# EAGLE design tiva_motor (EAGLE 7.5.0)
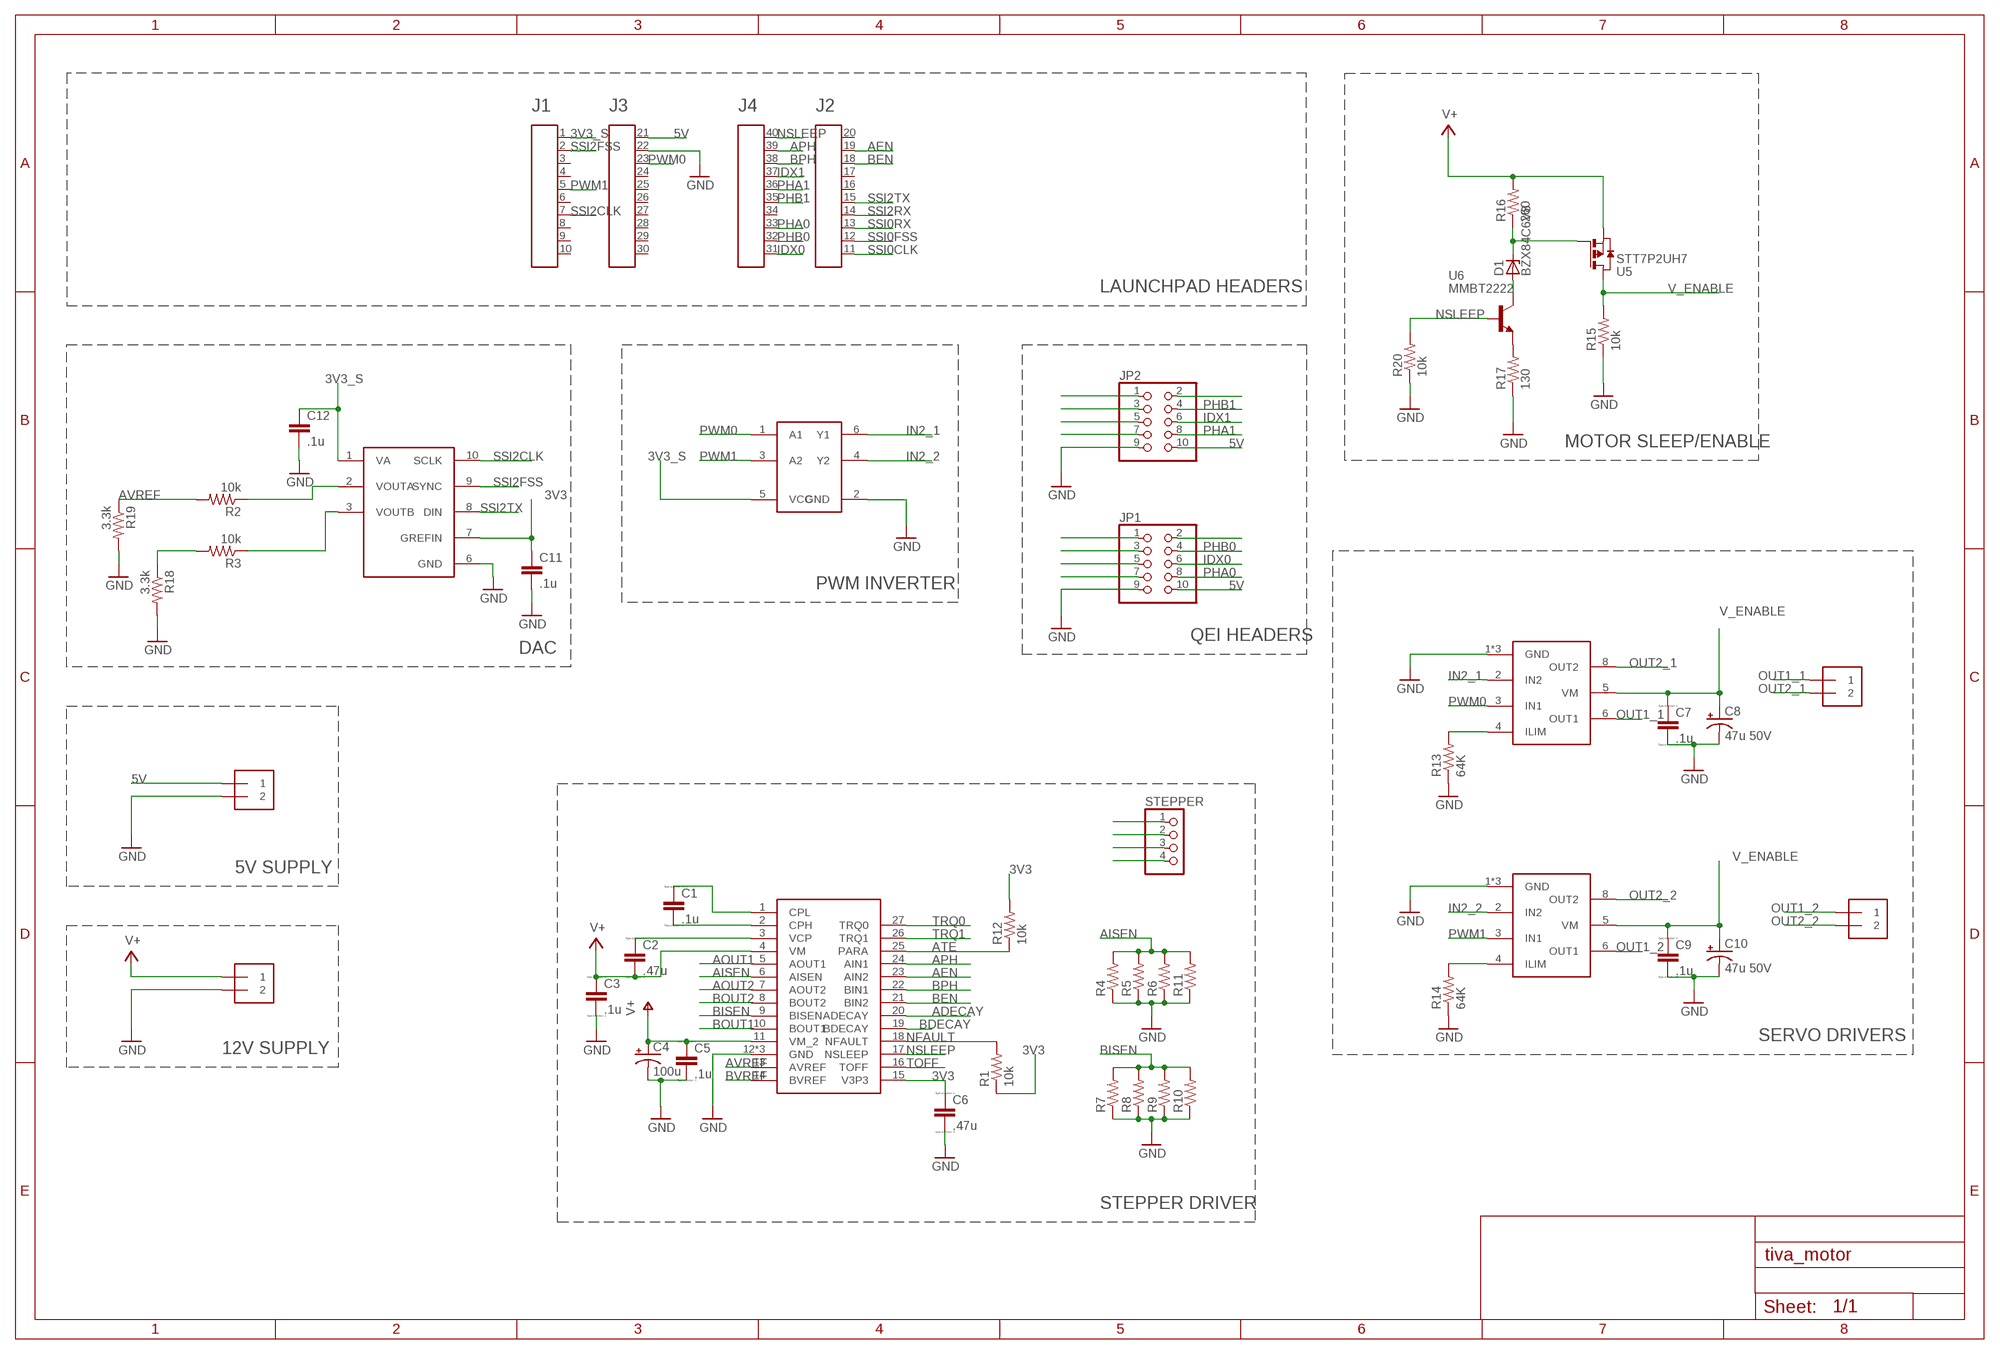
[diagram p0: schematic, sheet 1]

## Parts
5V  1X2-3.5MM  [1X2-3.5MM]
12V  1X2-3.5MM  [1X2-3.5MM]
A1  HEADER4X10-BOOSTERPACK  [4X10-BOOSTERPACK]
C1  .1u  CC0603  [C0603]
C2  .47u  CC0603  [C0603]
C3  .1u  CC0603  [C0603]
C4  100u  CPOL-US153CLV-0605  [153CLV-0605]
C5  .1u  CC0603  [C0603]
C6  .47u  CC0603  [C0603]
C7  .1u  CC0603  [C0603]
C8  47u 50V  CPOL-US153CLV-0605  [153CLV-0605]
C9  .1u  CC0603  [C0603]
C10  47u 50V  CPOL-US153CLV-0605  [153CLV-0605]
C11  .1u  C-EUC0402  [C0402]
C12  .1u  C-EUC0402  [C0402]
D1  BZX84C6V8  [SOT-23]
JP1  PINHD-2X5  [2X05]
JP2  PINHD-2X5  [2X05]
M1  1X2-3.5MM  [1X2-3.5MM]
M2  1X2-3.5MM  [1X2-3.5MM]
R1  10k  R-US_R0402  [R0402]
R2  10k  R-US_R0603  [R0603]
R3  10k  R-US_R0603  [R0603]
R4  R-US_R0603  [R0603]
R5  R-US_R0603  [R0603]
R6  R-US_R0603  [R0603]
R7  R-US_R0603  [R0603]
R8  R-US_R0603  [R0603]
R9  R-US_R0603  [R0603]
R10  R-US_R0603  [R0603]
R11  R-US_R0603  [R0603]
R12  10k  R-US_R0402  [R0402]
R13  64K  R-US_R0603  [R0603]
R14  64K  R-US_R0603  [R0603]
R15  10k  R-US_R0402  [R0402]
R16  260  R-US_R0805  [R0805]
R17  130  R-US_R1206  [R1206]
R18  3.3k  R-US_R0603  [R0603]
R19  3.3k  R-US_R0603  [R0603]
R20  10k  R-US_R0402  [R0402]
STEPPER  PINHD-1X4  [1X04]
U1  DRV8881  [TSSOP28]
U2  DRV8871  [SOIC127P600X170-9N]
U4  DRV8871  [SOIC127P600X170-9N]
U5  STT7P2UH7  [SOT23-6]
U6  MMBT2222  [SOT-23]
U8  DAC082S085  [SOP50P490X110-10N]
U9  NC7WZ14  [SC70-6]

## Nets
3V3: C6.1 C11.1 R1.1 R12.2 U1.15(V3P3) U8.7(GREFIN)
3V3_S: A1.1 C12.1 U8.1(VA) U9.5(VCC)
5V: 5V.1 A1.21 JP1.10 JP2.10
ADECAY: U1.20(ADECAY)
AEN: A1.19 U1.23(AIN2)
AISEN: R4.2 R5.2 R6.2 R11.2 U1.6(AISEN)
AOUT1: STEPPER.1 U1.5(AOUT1)
AOUT2: STEPPER.2 U1.7(AOUT2)
APH: A1.39 U1.24(AIN1)
ATE: R12.1 U1.25(PARA)
AVREF: R2.2 R19.1 U1.13(AVREF)
BDECAY: U1.19(BDECAY)
BEN: A1.18 U1.21(BIN2)
BISEN: R7.2 R8.2 R9.2 R10.2 U1.9(BISEN)
BOUT1: STEPPER.3 U1.10(BOUT1)
BOUT2: STEPPER.4 U1.8(BOUT2)
BPH: A1.38 U1.22(BIN1)
BVREF: R3.2 R18.1 U1.14(BVREF)
GND: 5V.2 12V.2 A1.22 C3.2 C4.- C5.2 C6.2 C7.2 C8.- C9.2 C10.- C11.2 C12.2 JP1.9 JP2.9 R4.1 R5.1 R6.1 R7.1 R8.1 R9.1 R10.1 R11.1 R13.1 R14.1 R15.1 R17.1 R18.2 R19.2 R20.1 U1.12(GND) U1.28(GND) U1.P$1(GND) U2.1(GND) U2.7(GND) U2.9(GND) U4.1(GND) U4.7(GND) U4.9(GND) U8.6(GND) U9.2(GND)
IDX0: A1.31 JP1.6
IDX1: A1.37 JP2.6
ILIM: R13.2 U2.4(ILIM)
ILIM1: R14.2 U4.4(ILIM)
IN2_1: U2.2(IN2) U9.6(Y1)
IN2_2: U4.2(IN2) U9.4(Y2)
N$1: C1.2 U1.2(CPH)
N$2: C1.1 U1.1(CPL)
N$3: C2.1 U1.3(VCP)
N$4: R17.2 U6.2(E)
N$5: D1.3(C) R16.1 U5.3(G)
N$6: R2.1 U8.2(VOUTA)
N$7: R3.1 U8.3(VOUTB)
N$8: D1.1(A) U6.3(C)
N$9: JP1.1
N$10: JP1.3
N$11: JP1.5
N$12: JP1.7
N$13: JP2.1
N$15: JP2.3
N$16: JP2.5
N$17: JP2.7
N$18: JP2.2
NC: JP1.2
NFAULT: R1.2 U1.18(NFAULT)
NSLEEP: A1.40 R20.2 U1.17(NSLEEP) U6.1(B)
OUT1_1: M1.1 U2.6(OUT1)
OUT1_2: M2.1 U4.6(OUT1)
OUT2_1: M1.2 U2.8(OUT2)
OUT2_2: M2.2 U4.8(OUT2)
PHA0: A1.33 JP1.8
PHA1: A1.36 JP2.8
PHB0: A1.32 JP1.4
PHB1: A1.35 JP2.4
PWM0: A1.23 U2.3(IN1) U9.1(A1)
PWM1: A1.5 U4.3(IN1) U9.3(A2)
SSI0CLK: A1.11
SSI0FSS: A1.12
SSI0RX: A1.13
SSI2CLK: A1.7 U8.10(SCLK)
SSI2FSS: A1.2 U8.9(SYNC)
SSI2RX: A1.14
SSI2TX: A1.15 U8.8(DIN)
TOFF: U1.16(TOFF)
TRQ0: U1.27(TRQ0)
TRQ1: U1.26(TRQ1)
V+: 12V.1 C2.2 C3.1 C4.+ C5.1 R16.2 U1.4(VM) U1.11(VM_2) U5.4(S)
V_ENABLE: C7.1 C8.+ C9.1 C10.+ R15.2 U2.5(VM) U4.5(VM) U5.1(D) U5.2(D) U5.5(D) U5.6(D)
Unconnected: A1.3 A1.4 A1.6 A1.8 A1.9 A1.10 A1.16 A1.17 A1.20 A1.24 A1.25 A1.26 A1.27 A1.28 A1.29 A1.30 A1.34

## Notes on the sheet
- LAUNCHPAD HEADERS
- MOTOR SLEEP/ENABLE
- PWM INVERTER
- QEI HEADERS
- DAC
- 5V SUPPLY
- SERVO DRIVERS
- 12V SUPPLY
- STEPPER DRIVER

## Library data of the parts
5V 12V M1 M2 = adafruit:1X2: 3.5mm Terminal block http://www.ladyada.net/library/pcb/eaglelibrary.html
A1 = Public_BP_Library:HEADER4X10-BOOSTERPACK
C1-C3 C5-C7 C9 = eagle-ltspice:C: CAPACITOR, European symbol; SPICEMODEL: NONE; SPICEPREFIX: C
C4 C8 C10 = adafruit:CPOL-US: POLARIZED CAPACITOR, American symbol
C11 C12 = rcl:C-EU: CAPACITOR, European symbol
D1 = deanParts:BZX84C6V8: 6.8V zener
JP1 JP2 = pinhead:PINHD-2X5: PIN HEADER
R1-R20 = adafruit:R-US_: RESISTOR, American symbol
STEPPER = pinhead:PINHD-1X4: PIN HEADER
U1 = deanParts:DRV8881: DRV8881 Motor driver
U2 U4 = deanParts:DRV8871: DRV8871 PWM motor controller
U5 = deanParts:STT7P2UH7: P channel enhancement mosfet STT7P2UH7
U6 = deanParts:MMBT2222
U8 = deanParts:DAC082S085: 8-Bit Micro Power DUAL Digital-to-Analog Converter with Rail-to-Rail Output
U9 = deanParts:NC7WZ14: UHS dual inverter with schmitt trigger inputs

## Board
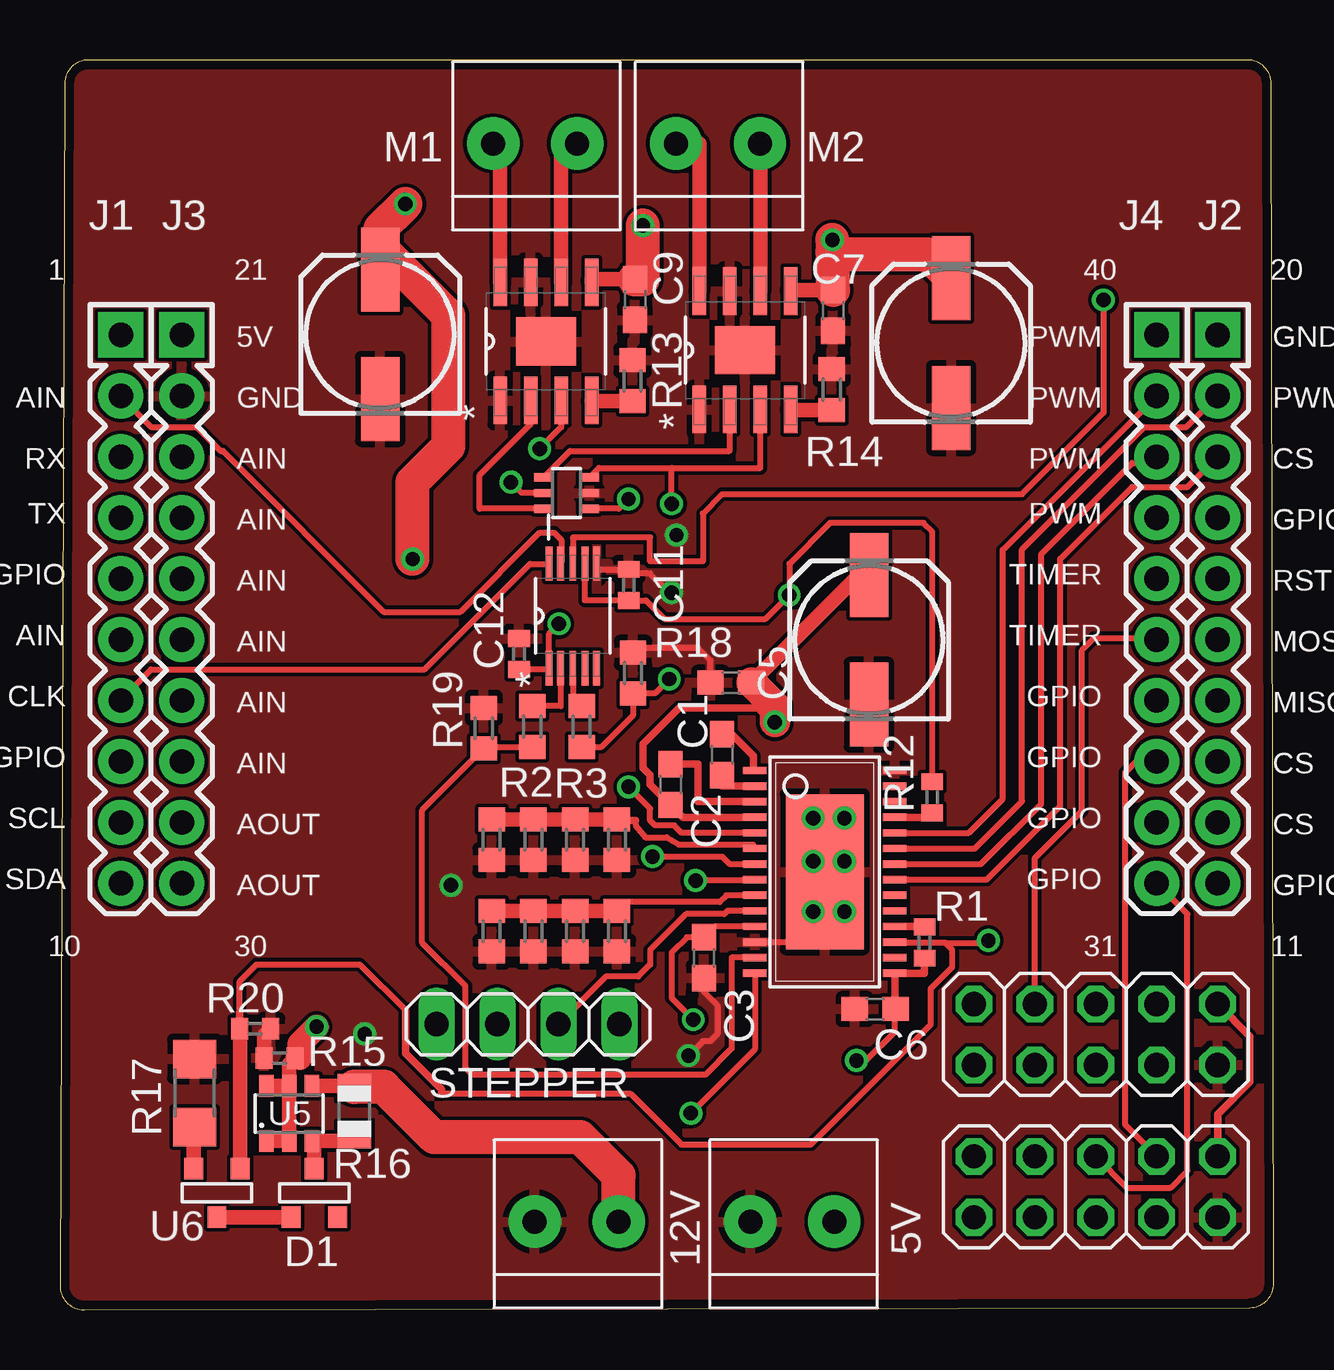
[diagram p1: board, top side]
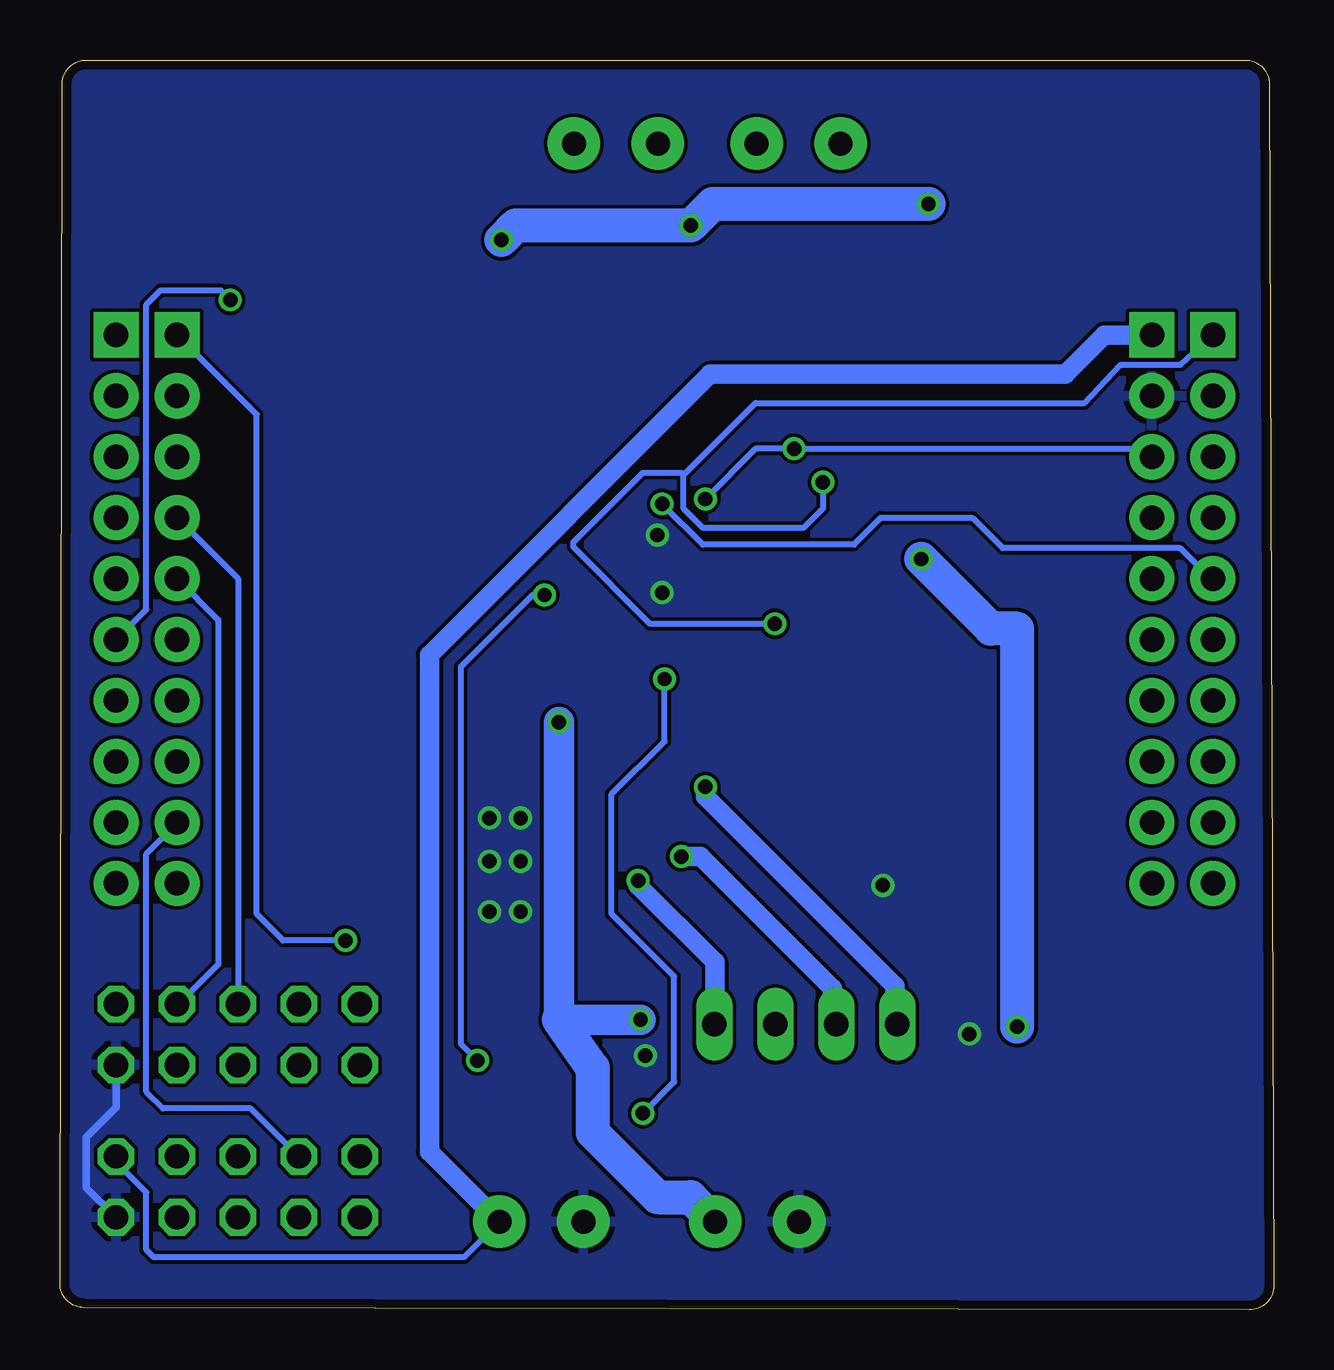
[diagram p2: board, bottom side, seen from below]

Size 50.59 x 52.1 mm. Coordinates in mm from the lower left corner, seen from the top.
Outline: 0.19,51.1 0,1 arc90 1,0 49.6,0.1 arc90 50.59,1.1 50.5,51.1 arc90 49.5,52.1 1.19,52.1 arc90 0.19,51.1
Copper layers (1*16): Top 0.0356mm / dielectric 1.5011mm / Bottom 0.0356mm
Design rules "oshpark-2layer *": minimum track width 6mil, minimum drill 13mil, track to track 6mil, track to pad 6mil, pad to pad 6mil, via to via 6mil, smd to smd 6mil, copper to edge 15mil, drill to drill 6mil, minimum pad ring 7mil, minimum via ring 7mil, stop-mask expansion 0mil, vias tented up to drill 0mil, thermal gap 10mil

### Footprints (pad centres in the part's own frame; a part is rotated, then mirrored left to right if it is on the bottom)
1X2-3.5MM = drill 1 pad 2.184: 1 1.8,0; 2 -1.7,0
4X10-BOOSTERPACK = drill 1.016 pad 1.88 square: 1 0,10.16; 20 45.72,10.16; 21 2.54,10.16; 40 43.18,10.16 | drill 1.016 pad 1.88: 2 0,7.62; 3 0,5.08; 4 0,2.54; 5 0,0; 6 0,-2.54; 7 0,-5.08; 8 0,-7.62; 9 0,-10.16; 10 0,-12.7; 11 45.72,-12.7; 12 45.72,-10.16; 13 45.72,-7.62; 14 45.72,-5.08; 15 45.72,-2.54; 16 45.72,0; 17 45.72,2.54; 18 45.72,5.08; 19 45.72,7.62; 22 2.54,7.62; 23 2.54,5.08; 24 2.54,2.54; 25 2.54,0; 26 2.54,-2.54; 27 2.54,-5.08; 28 2.54,-7.62; 29 2.54,-10.16; 30 2.54,-12.7; 31 43.18,-12.7; 32 43.18,-10.16; 33 43.18,-7.62; 34 43.18,-5.08; 35 43.18,-2.54; 36 43.18,0; 37 43.18,2.54; 38 43.18,5.08; 39 43.18,7.62
C0603 = smd 1.1 x 1: 1 -0.85,0; 2 0.85,0
153CLV-0605 = smd 3.5 x 1.6: + 2.7,0; - -2.7,0
C0402 = smd 0.7 x 0.9: 1 -0.65,0; 2 0.65,0
SOT-23 = smd 0.787 x 0.889: 1 0.991,1.016; 2 -0.94,1.016; 3 0.025,-1.016
2X05 = drill 1.016 octagon: 1 -5.08,-1.27; 2 -5.08,1.27; 3 -2.54,-1.27; 4 -2.54,1.27; 5 0,-1.27; 6 0,1.27; 7 2.54,-1.27; 8 2.54,1.27; 9 5.08,-1.27; 10 5.08,1.27
R0402 = smd 0.7 x 0.9: 1 -0.65,0; 2 0.65,0
R0603 = smd 1 x 1.1: 1 -0.85,0; 2 0.85,0
R0805 = smd 1.1 x 1.4: 1 -1,0; 2 1,0
R1206 = smd 1.6 x 1.803: 1 -1.422,0; 2 1.422,0
1X04 = drill 1.016 long: 1 -3.81,0; 2 -1.27,0; 3 1.27,0; 4 3.81,0
TSSOP28 = smd 0.305 x 0.991: 1 -4.225,-2.918; 2 -3.575,-2.918; 3 -2.925,-2.918; 4 -2.275,-2.918; 5 -1.625,-2.918; 6 -0.975,-2.918; 7 -0.325,-2.918; 8 0.325,-2.918; 9 0.975,-2.918; 10 1.625,-2.918; 11 2.275,-2.918; 12 2.925,-2.918; 13 3.575,-2.918; 14 4.225,-2.918; 15 4.225,2.918; 16 3.575,2.918; 17 2.925,2.918; 18 2.275,2.918; 19 1.625,2.918; 20 0.975,2.918; 21 0.325,2.918; 22 -0.325,2.918; 23 -0.975,2.918; 24 -1.625,2.918; 25 -2.275,2.918; 26 -2.925,2.918; 27 -3.575,2.918; 28 -4.225,2.918 | smd 6.452 x 3.251: P$1 0,0
SOIC127P600X170-9N = smd 1.981 x 0.559: 1 -2.464,1.905; 2 -2.464,0.635; 3 -2.464,-0.635; 4 -2.464,-1.905; 5 2.464,-1.905; 6 2.464,-0.635; 7 2.464,0.635; 8 2.464,1.905 | smd 2.007 x 2.489: 9 0,0
SOT23-6 = smd 0.6 x 0.9: 1 -0.95,-1.15; 2 0,-1.15; 3 0.95,-1.15; 4 0.95,1.15; 5 0,1.15; 6 -0.95,1.15
SOP50P490X110-10N = smd 1.422 x 0.279: 1 -2.184,0.991; 2 -2.184,0.508; 3 -2.184,0; 4 -2.184,-0.508; 5 -2.184,-0.991; 6 2.184,-0.991; 7 2.184,-0.508; 8 2.184,0; 9 2.184,0.508; 10 2.184,0.991
SC70-6 = smd 0.35 x 0.8: 1 -0.65,-0.95; 2 0,-0.95; 3 0.65,-0.95; 4 0.65,0.95; 5 0,0.95; 6 -0.65,0.95

### Placement (x,y rotation side)
5V  30.48,3.68 0 top
12V  21.49,3.68 0 top
A1  2.54,30.48 0 top
C1  27.6,23.14 270 top
C2  25.46,21.9 270 top
C3  26.84,14.68 270 top
C4  33.73,27.93 90 top
C5  27.97,26.15 180 top
C6  33.98,12.54 180 top
C7  32.23,41.66 270 top
C8  37.15,40.3 90 top
C9  23.97,42.11 270 top
C10  13.35,40.67 90 top
C11  23.71,30.22 90 top
C12  19.14,27.34 90 top
D1  10.63,4.88 180 top
JP1  43.18,5.13 0 top
JP2  43.18,11.48 0 top
M1  19.76,48.62 0 top
M2  27.38,48.62 0 top
R1  36.04,15.31 90 top
R2  19.69,24.32 270 top
R3  21.75,24.32 270 top
R4  23.22,19.6 90 top
R5  21.48,19.6 90 top
R6  19.74,19.6 90 top
R7  23.22,15.79 90 top
R8  21.48,15.79 90 top
R9  19.74,15.79 90 top
R10  18,15.79 90 top
R11  18,19.6 90 top
R12  36.36,21.37 90 top
R13  23.87,38.73 270 top
R14  32.17,38.36 270 top
R15  9.16,10.5 0 top
R16  12.27,8.29 90 top
R17  5.62,9.04 270 top
R18  23.89,26.55 90 top
R19  17.67,24.25 90 top
R20  8.14,11.72 180 top
STEPPER  19.51,11.91 0 top
U1  31.88,18.26 270 top
U2  20.26,40.37 90 top
U4  28.56,40 90 top
U5  9.56,8.19 0 top
U6  6.52,4.88 0 top
U8  21.38,28.93 90 top
U9  21.12,34.05 90 top

### Tracks (layer width: path | path; a pad name or v marks a point on that pad's centre or on a via)
3V3  (via drill 0.6)
  Top 0.254: U8.7 21.88,29.57 C11.1 24.43,29.57 25.2,28.8 29.4,28.8 v30.4,29.8 30.4,31.1 32.1,32.8 36,32.8 36.36,32.44 R12.2 | v33.2,10.4 33.6,10.4 34.8,11.6 34.8,12.51 C6.1
  Top 0.305: C6.1 34.79,12.57 U1.15 36.04,14.03 R1.1
  Bottom 0.254: v30.4,29.8 30.9,29.8 33.9,26.8 33.9,11.1 v33.2,10.4
3V3_S  (via drill 0.6)
  Top 0.254: C12.1 20.39,26.69 U8.1 20.39,28.19 v20.8,28.6 | U9.5 19.25,34.05 v18.8,34.5
  Bottom 0.254: v18.8,34.5 18.8,33.4 19.6,32.6 23.8,32.6 24.6,33.4 24.6,34.8 | 24.6,34.8 21.6,37.8 7.9,37.8 6.4,39.4 3.88,39.4 A1.1 | v20.8,28.6 26,28.6 29.2,31.8 29.2,32 26.3,34.9 24.7,34.9 24.6,34.8
5V
  Top 0.305: JP1.10 48.26,8.16 49.6,9.5 49.6,11.41 JP2.10
  Bottom 0.254: 5V.1 33.76,2.2 46.7,2.2 47,2.5 47,4.9 48.26,6.16 JP1.10
  Bottom 0.813: A1.21 7.06,40.64 8.7,39 23.5,39 35.2,27.3 35.2,6.6 5V.1
AEN
  Top 0.254: U1.23 38.13,19.23 40.1,21.2 40.1,31.7 45.2,36.8 46.96,36.8 A1.19
AISEN
  Top 0.254: 24,20.4 24,20.2 24.4,19.7 25.3,19.7 25.8,19.4 28.89,19.4 U1.6
  Top 0.305: 24,20.4 23.27,20.4 R4.2
  Top 0.61: R4.2 R5.2 R6.2 R11.2
AOUT1  (via drill 0.6)
  Top 0.254: U1.5 25.91,19.88 25.6,20.2 24.8,20.2 24.6,20.4 24.6,20.9 v23.7,21.8
  Bottom 0.813: v23.7,21.8 23.7,21.4 15.8,13.5 15.8,12.01 STEPPER.1
AOUT2  (via drill 0.6)
  Top 0.254: v24.7,18.9 27.6,18.9 27.9,18.6 28.94,18.6 U1.7
  Bottom 0.813: v24.7,18.9 23.9,18.9 18.4,13.4 18.4,12.07 STEPPER.2
APH
  Top 0.254: U1.24 37.88,19.88 39.3,21.3 39.3,31.68 A1.39
ATE
  Top 0.305: U1.25 36.24,20.53 R12.1
AVREF
  Top 0.254: R2.2 17.67,23.47 R19.1 15.1,20.83 15.1,15.3 16.9,13.5 16.9,10.1 17.2,9.8 26.9,9.8 28,10.9 28,14.68 U1.13
BEN
  Top 0.254: U1.21 38.63,17.93 41.7,21 41.7,31.3 44.7,34.3 47,34.3 A1.18
BISEN
  Top 0.254: U1.9 27.78,17.28 27.5,17 23.58,17 R7.2
  Top 0.61: R7.2 R8.2 R9.2 R10.2
BOUT1
  Top 0.254: U1.10 27.83,16.63 27.7,16.5 26.1,16.5 24.6,15 24.6,14.4 24.1,13.9 22.77,13.9 STEPPER.3
BOUT2  (via drill 0.6)
  Top 0.254: U1.8 28.92,17.9 v26.5,17.9
  Bottom 0.813: v26.5,17.9 26.5,17.7 23.3,14.5 23.3,11.93 STEPPER.4
BPH
  Top 0.254: U1.22 38.38,18.58 40.9,21.1 40.9,31.5 44.7,35.3 45.46,35.3 A1.38
BVREF  (via drill 0.6)
  Top 0.254: R3.2 22.57,23.47 23.9,24.8 R18.1 24.8,25.7 v25.4,26.3 | U1.14 28.96,10.86 v26.3,8.2
  Bottom 0.254: v26.3,8.2 25,9.5 25,13.9 27.6,16.5 27.6,21.5 25.4,23.7 v25.4,26.3
GND  (via drill 0.6)
  Top 0.254: U8.6 22.37,30.87 C11.2 23.88,30.7 24.6,30.7 25.4,29.9 v25.5,29.9 | C3.2 26.84,13.26 27.4,12.7 27.4,11.5 27.1,11.2 26.8,11.2 v26.2,10.6 | U1.12 31.03,15.33 31.4,15.7 v31.4,16.6 | C5.2 27.12,27.08 26.6,27.6 24.09,27.6 R18.2
  Top 0.61: R15.1 8.51,11.44 R20.1
  Bottom 0.305: JP2.9 48.26,8.44 49.5,7.2 49.5,5.1 JP1.9
  other vias: 16.3,17.7 32.7,16.6 31.4,18.7 32.7,18.7 31.4,20.5 32.7,20.5 25.7,32.3 12.7,11.5
  pour Bottom: -5.08,-2.54 162.56,-2.54 162.56,104.14 -5.08,104.14
  pour Top: -6.35,-2.54 165.1,-2.54 165.1,106.68 -6.35,106.68
IDX0
  Top 0.254: JP1.6 44.48,5.1 46.3,5.1 47,5.8 47,16.5 A1.31
IDX1
  Bottom 0.254: A1.37 43.18,30.48 JP2.6
ILIM
  Top 0.61: U2.4 22.16,37.88 R13.2
ILIM1
  Top 0.61: U4.4 30.46,37.51 R14.2
IN2_1
  Top 0.254: U9.6 17.5,33.4 17.5,34.8 19.6,36.9 19.6,37.88 U2.2
IN2_2
  Top 0.254: U9.4 21.27,35.8 27.9,35.8 27.92,35.82 U4.2
N$1
  Top 0.305: C1.2 27.6,21.83 U1.2
N$2
  Top 0.305: C1.1 28.01,23.99 28.9,23.1 28.9,22.55 U1.1
N$3
  Top 0.305: C2.1 26.6,22.75 26.6,21.2 U1.3
N$4
  Top 0.61: U6.2 5.58,7.58 R17.2
N$5
  Top 0.61: D1.3 10.6,6.94 U5.3 12.02,7.04 R16.1
N$6
  Top 0.254: U8.2 20.87,25.17 R2.1
N$7
  Top 0.254: U8.3 21.38,25.17 R3.1
N$8
  Top 0.61: D1.1 U6.3
NFAULT
  Top 0.305: U1.18 36.01,15.98 R1.2
NSLEEP  (via drill 0.6)
  Top 0.254: 36.9,15.3 37.2,15 37.2,14.3 36.3,13.4 36.3,11.9 31.3,6.9 25.9,6.9 23.8,9 15.9,9 | 36.9,15.3 34.83,15.3 U1.17 | 36.9,15.3 38.6,15.3 v38.7,15.4 | 7.5,12.4 7.5,13.7 8.2,14.4 12.5,14.4 14.4,12.5
  Top 0.305: 15.9,9 15.9,9.2 14.4,10.7 14.4,12.5 | 7.5,12.4 R20.2
  Top 0.61: U6.1 7.51,11.7 R20.2
  Bottom 0.254: v38.7,15.4 41.3,15.4 42.4,16.5 42.4,37.32 A1.40
OUT1_1
  Top 0.61: M1.1 20.89,48.62 U2.6
OUT1_2
  Top 0.61: M2.1 29.19,48.62 U4.6
OUT2_1
  Top 0.61: M1.2 18.35,48.62 U2.8
OUT2_2
  Top 0.61: M2.2 26.65,48.62 U4.8
PHA0
  Top 0.254: JP1.8 44.4,7.72 44.4,22.4 44.86,22.86 A1.33
PHA1
  Bottom 0.254: A1.36 44,28.76 44,14.4 45.65,12.75 JP2.8
PHB0
  Bottom 0.254: JP1.4 42.64,8.4 46.3,8.4 47,9.1 47,19 45.72,20.28 A1.32
PHB1
  Top 0.254: JP2.4 40.64,18.84 42.6,20.8 42.6,27.5 43.1,28 45.66,28 A1.35
PWM0  (via drill 0.6)
  Top 0.254: U2.3 20.89,36.79 v20,35.9 | v23.7,33.8 23.3,33.4 U9.1
  Bottom 0.254: v23.7,33.8 21.6,35.9 v20,35.9 5.42,35.9 A1.23
PWM1  (via drill 0.6)
  Top 0.254: U9.3 22.47,35.1 25.5,35.1 | 25.5,35.1 29.2,35.1 29.19,35.1 U4.3 | v25.5,33.6 25.5,35.1
  Bottom 0.254: v25.5,33.6 23.8,31.9 17.5,31.9 16.38,33.02 16.36,33 12.55,33 11.3,31.75 3.9,31.75 2.63,30.48 A1.5
SSI2CLK
  Top 0.254: A1.7 2.54,25.44 3.8,26.7 15.2,26.7 19.6,31.1 20.37,31.1 U8.10
SSI2FSS
  Top 0.254: A1.2 2.54,38.06 3.8,36.8 5.7,36.8 6.7,35.8 6.8,35.8 13.5,29.1 16.7,29.1 20,32.4 20.6,32.4 20.9,32.1 20.9,31.14 U8.9
SSI2TX  (via drill 0.6)
  Top 0.254: v43.5,42.1 43.5,37.4 40.1,34 27.6,34 26.8,33.2 26.8,31.2 24.6,31.2 24.6,32.2 21.4,32.2 21.38,32.18 U8.8
  Bottom 0.254: A1.15 47,29.2 47,41.9 46.4,42.5 43.9,42.5 v43.5,42.1
V+  (via drill 0.6)
  Top 0.254: U1.11 27.29,15.98 C3.1 26.13,15.53 25.5,14.9 25.5,13 v26.4,12.1
  Top 0.305: U1.4 25.97,20.53 C2.2 24.6,21.91 24.6,22.3 24.3,22.6 24.3,23.6 25.8,25.1 29.1,25.1 29.7,24.5 v29.8,24.5
  Top 0.61: U5.4 12.22,9.34 R16.2 | C4.+ 33.3,30.63 C5.1
  Top 1.27: v29.8,24.5 29.8,25.17 C5.1
  Top 1.422: 12V.1 23.29,5.61 21.7,7.2 15.6,7.2 13.5,9.3 R16.2
  Bottom 1.27: v26.4,12.1 29.8,12.1 v29.8,24.5
  Bottom 1.422: 29.8,12.1 28.4,10.09 28.4,7.4 25.7,4.7 24.31,4.7 12V.1
V_ENABLE  (via drill 0.6)
  Top 0.61: U5.1 U5.2 U5.5 | U5.6 U5.5 | U5.5 9.56,10.25 R15.2 | U2.5 22.16,42.96 C9.1 23.97,43.07 | U4.5 30.46,42.51 C7.1 32.23,42.6
  Top 0.813: R15.2 10,10.5
  Top 1.016: 10,10.5 10,11.1 v10.7,11.8
  Top 1.422: C9.1 24.3,42.96 v24.3,45.2 | v32.2,44.6 32.2,44.1 | 32.2,44.1 32.2,42.54 C7.1 | 32.2,44.1 32.3,44 36.15,44 C8.+ | C10.+ 13.35,44.3 | 13.35,44.3 13.35,45.05 v14.4,46.1 | v14.7,31.3 14.7,34.5 16.2,36 16.2,41.45 13.35,44.3
  Bottom 1.422: v32.2,44.6 31.6,45.2 v24.3,45.2 23.4,46.1 v14.4,46.1 | v10.7,11.8 10.7,28.4 11.8,28.4 v14.7,31.3